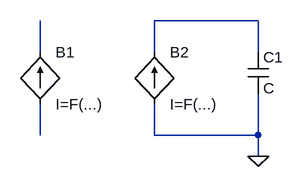
[diagram p0: schematic General_SPICE.asc]
General_SPICE.asc, the LTspice schematic file:
Version 4
SHEET 1 880 680
WIRE 464 32 304 32
WIRE 128 80 128 32
WIRE 304 80 304 32
WIRE 464 80 464 32
WIRE 128 208 128 160
WIRE 304 208 304 160
WIRE 464 208 464 144
WIRE 464 208 304 208
WIRE 464 240 464 208
FLAG 464 240 0
SYMBOL bi2 128 80 R0
SYMATTR InstName B1
SYMBOL bi2 304 80 R0
SYMATTR InstName B2
SYMBOL cap 448 80 R0
SYMATTR InstName C1

The netlist it stands for:
* General_SPICE.asc
B1 N003 N002 I=F(...)
B2 0 N001 I=F(...)
C1 N001 0 C
.backanno
.end